# EAGLE design ospy_hw3.3 (EAGLE 9.5.2)
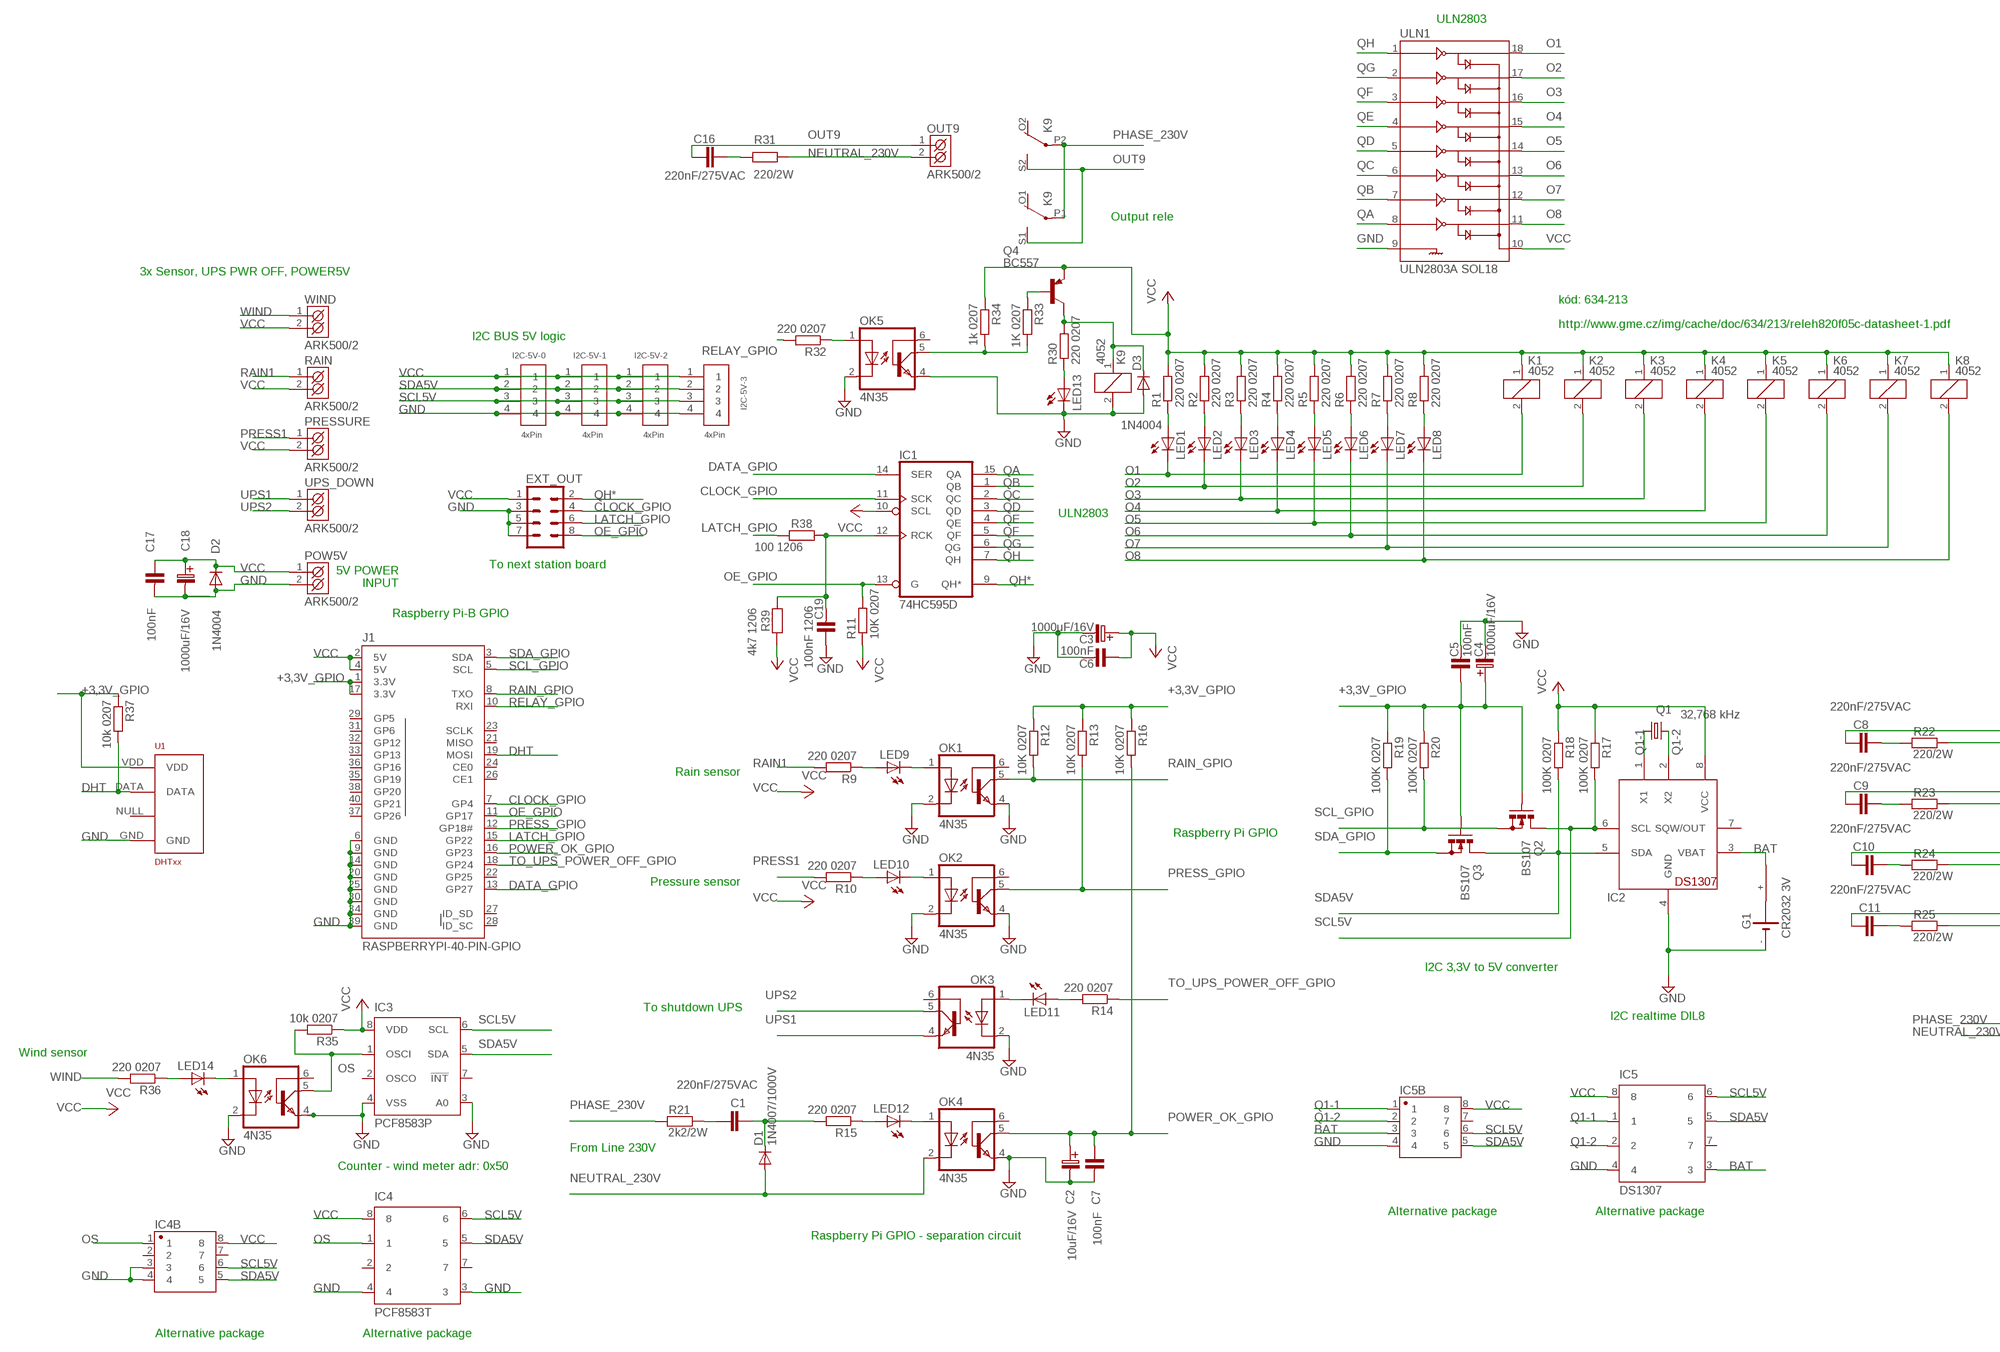
[diagram p0: schematic, sheet 1, part 1 of 2]
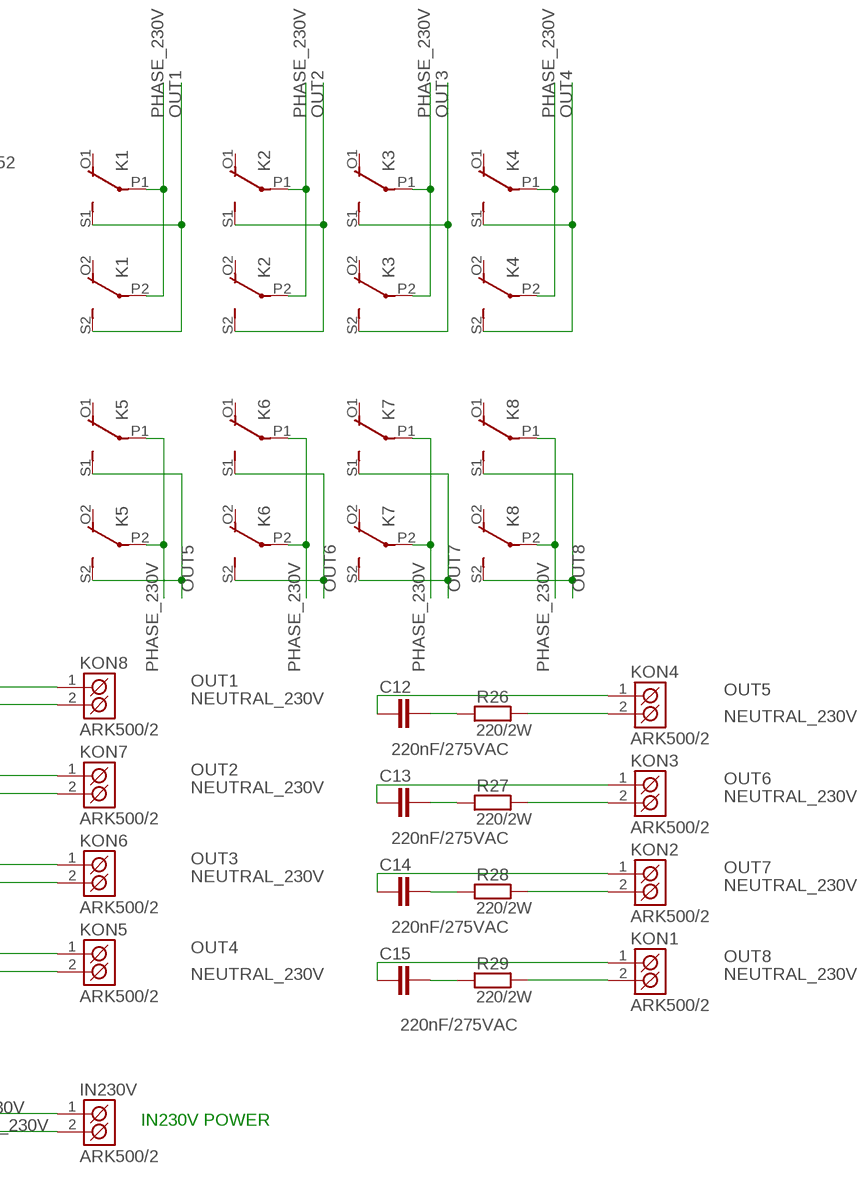
[diagram p1: schematic, sheet 1, part 2 of 2]

## Parts
C1  220nF/275VAC  C-EU225-087X268  [C225-087X268]
C2  10uF/16V  #_RADIAL_POUZDRA5  [C_EL_5]
C3  1000uF/16V  #_RADIAL_POUZDRA5  [C_EL_5]
C4  1000uF/16V  #_RADIAL_POUZDRA5  [C_EL_5]
C5  100nF  100N-J/63V  [RM5_2,5]
C6  100nF  100N-J/63V  [RM5_2,5]
C7  100nF  100N-J/63V  [RM5_2,5]
C8  220nF/275VAC  C-EU225-087X268  [C225-087X268]
C9  220nF/275VAC  C-EU225-087X268  [C225-087X268]
C10  220nF/275VAC  C-EU225-087X268  [C225-087X268]
C11  220nF/275VAC  C-EU225-087X268  [C225-087X268]
C12  220nF/275VAC  C-EU225-087X268  [C225-087X268]
C13  220nF/275VAC  C-EU225-087X268  [C225-087X268]
C14  220nF/275VAC  C-EU225-087X268  [C225-087X268]
C15  220nF/275VAC  C-EU225-087X268  [C225-087X268]
C16  220nF/275VAC  C-EU225-087X268  [C225-087X268]
C17  100nF  100N-J/63V  [RM5_2,5]
C18  1000uF/16V  #_RADIAL_POUZDRA5  [C_EL_5]
C19  100nF 1206  C-KER_1206  [1206]
D1  1N4007/1000V  1N4004  [DO41-10]
D2  1N4004  [DO41-10]
D3  1N4004  [DO41-10]
EXT_OUT  M04X2  [2X4]
G1  CR2032 3V  B2430UNI  [B2430UNI]
I2C-5V-0  4xPin  1X4-CLEANBIG  [1X04-CLEANBIG]
I2C-5V-1  4xPin  1X4-CLEANBIG  [1X04-CLEANBIG]
I2C-5V-2  4xPin  1X4-CLEANBIG  [1X04-CLEANBIG]
I2C-5V-3  4xPin  1X4-CLEANBIG  [1X04-CLEANBIG]
IC1  74HC595D  [SO16]
IC2  DS1307  [DIL08]
IC3  PCF8583P  [DIL08]
IC4  PCF8583T  [SO8-7_5]
IC4B  GENERIC-SOIC8  [SO08-UNIVERSAL]
IC5  DS1307  PCF8583T  [SO8-7_5]
IC5B  GENERIC-SOIC8  [SO08-UNIVERSAL]
IN230V  ARK500/2  [ARK500/2]
J1  RASPBERRYPI-40-PIN-GPIO  [2X20-SHROUDED]
K1  4052  [F4052]
K2  4052  [F4052]
K3  4052  [F4052]
K4  4052  [F4052]
K5  4052  [F4052]
K6  4052  [F4052]
K7  4052  [F4052]
K8  4052  [F4052]
K9  4052  [F4052]
KON1  ARK500/2  [ARK500/2]
KON2  ARK500/2  [ARK500/2]
KON3  ARK500/2  [ARK500/2]
KON4  ARK500/2  [ARK500/2]
KON5  ARK500/2  [ARK500/2]
KON6  ARK500/2  [ARK500/2]
KON7  ARK500/2  [ARK500/2]
KON8  ARK500/2  [ARK500/2]
LED1  LED3MM  [LED3MM]
LED2  LED3MM  [LED3MM]
LED3  LED3MM  [LED3MM]
LED4  LED3MM  [LED3MM]
LED5  LED3MM  [LED3MM]
LED6  LED3MM  [LED3MM]
LED7  LED3MM  [LED3MM]
LED8  LED3MM  [LED3MM]
LED9  LED3MM  [LED3MM]
LED10  LED3MM  [LED3MM]
LED11  LED3MM  [LED3MM]
LED12  LED3MM  [LED3MM]
LED13  LED3MM  [LED3MM]
LED14  LED3MM  [LED3MM]
OK1  4N35  [DIL06]
OK2  4N35  [DIL06]
OK3  4N35  [DIL06]
OK4  4N35  [DIL06]
OK5  4N35  [DIL06]
OK6  4N35  [DIL06]
OUT9  ARK500/2  [ARK500/2]
POW5V  ARK500/2  [ARK500/2]
PRESSURE  ARK500/2  [ARK500/2]
Q1  32,768 kHz  CRYSTALTC26V  [TC26V]
Q2  BS107  BS170  [SOT54E]
Q3  BS107  BS170  [SOT54E]
Q4  BC557  [TO92]
R1  220 0207  R-EU_0207/10  [0207/10]
R2  220 0207  R-EU_0207/10  [0207/10]
R3  220 0207  R-EU_0207/10  [0207/10]
R4  220 0207  R-EU_0207/10  [0207/10]
R5  220 0207  R-EU_0207/10  [0207/10]
R6  220 0207  R-EU_0207/10  [0207/10]
R7  220 0207  R-EU_0207/10  [0207/10]
R8  220 0207  R-EU_0207/10  [0207/10]
R9  220 0207  R-EU_0207/10  [0207/10]
R10  220 0207  R-EU_0207/10  [0207/10]
R11  10K 0207  R-EU_0207/10  [0207/10]
R12  10K 0207  R-EU_0207/10  [0207/10]
R13  10K 0207  R-EU_0207/10  [0207/10]
R14  220 0207  R-EU_0207/10  [0207/10]
R15  220 0207  R-EU_0207/10  [0207/10]
R16  10K 0207  R-EU_0207/10  [0207/10]
R17  100K 0207  R-EU_0207/10  [0207/10]
R18  100K 0207  R-EU_0207/10  [0207/10]
R19  100K 0207  R-EU_0207/10  [0207/10]
R20  100K 0207  R-EU_0207/10  [0207/10]
R21  2k2/2W  W2_220R  [R__2W]
R22  220/2W  W2_220R  [R__2W]
R23  220/2W  W2_220R  [R__2W]
R24  220/2W  W2_220R  [R__2W]
R25  220/2W  W2_220R  [R__2W]
R26  220/2W  W2_220R  [R__2W]
R27  220/2W  W2_220R  [R__2W]
R28  220/2W  W2_220R  [R__2W]
R29  220/2W  W2_220R  [R__2W]
R30  220 0207  R-EU_0207/10  [0207/10]
R31  220/2W  W2_220R  [R__2W]
R32  220 0207  R-EU_0207/10  [0207/10]
R33  1K 0207  R-EU_0207/10  [0207/10]
R34  1k 0207  R-EU_0207/10  [0207/10]
R35  10k 0207  R-EU_0207/10  [0207/10]
R36  220 0207  R-EU_0207/10  [0207/10]
R37  10k 0207  R-EU_0207/10  [0207/10]
R38  100 1206  R_1206  [1206]
R39  4k7 1206  R_1206  [1206]
RAIN  ARK500/2  [ARK500/2]
U1  DHTxx  RHT03_DHT-22_AM2302RA  [RHT03_DHT-22/RA]
ULN1  ULN2803A SOL18  ULN2803SOICW  [SO18L]
UPS_DOWN  ARK500/2  [ARK500/2]
WIND  ARK500/2  [ARK500/2]

## Nets
+3,3V_GPIO: C4.C+(C_EL+) C5.1 J1.1(3.3V) J1.17(3.3V) Q2.G Q3.G R12.1 R13.1 R16.1 R19.1 R20.1 R37.1 U1.VDD
BAT: G1.+ IC2.3(VBAT) IC5.3 IC5B.3
CLOCK_GPIO: EXT_OUT.4 IC1.11(SCK) J1.7(GP4)
DATA_GPIO: IC1.14(SER) J1.13(GP27)
DHT: J1.19(MOSI) R37.2 U1.DATA
GND: C2.C-(C_EL-) C3.C-(C_EL-) C4.C-(C_EL-) C5.2 C6.2 C7.2 C17.2 C18.C-(C_EL-) C19.1 D2.A D3.A EXT_OUT.3 EXT_OUT.5 EXT_OUT.7 G1.- I2C-5V-0.4 I2C-5V-1.4 I2C-5V-2.4 I2C-5V-3.4 IC2.4(GND) IC3.3(A0) IC3.4(VSS) IC4.3 IC4.4 IC4B.3 IC4B.4 IC5.4 IC5B.4 J1.6(GND) J1.9(GND) J1.14(GND) J1.20(GND) J1.25(GND) J1.30(GND) J1.34(GND) J1.39(GND) K9.2 LED13.K(C) OK1.2(C) OK1.4(EMI) OK2.2(C) OK2.4(EMI) OK3.2(C) OK4.4(EMI) OK5.2(C) OK5.4(EMI) OK6.2(C) OK6.4(EMI) POW5V.2(K2) U1.GND ULN1.9
LATCH_GPIO: EXT_OUT.6 J1.15(GP22) R38.1
N$1: LED14.A R36.1
N$3: LED14.K(C) OK6.1(A)
N$13: C19.2 IC1.12(RCK) R38.2 R39.2
N$17: LED1.A R1.1
N$18: LED2.A R2.1
N$19: LED3.A R3.1
N$20: LED4.A R4.1
N$21: LED5.A R5.1
N$22: LED6.A R6.1
N$23: LED7.A R7.1
N$24: LED8.A R8.1
N$26: LED9.A R9.1
N$27: LED9.K(C) OK1.1(A)
N$28: LED10.K(C) OK2.1(A)
N$29: LED10.A R10.1
N$30: LED12.A R15.1
N$31: LED12.K(C) OK4.1(A)
N$32: LED11.K(C) OK3.1(A)
N$33: LED11.A R14.2
N$36: C10.2 R24.1
N$37: C9.2 R23.1
N$38: C1.1 R21.2
N$39: C8.2 R22.1
N$40: C11.2 R25.1
N$41: C12.2 R26.1
N$42: Q4.2(B) R33.1
N$43: C13.2 R27.1
N$44: C14.2 R28.1
N$45: C15.2 R29.1
N$46: LED13.A R30.1
N$47: C16.2 R31.1
N$49: OK5.1(A) R32.1
N$50: OK5.5(COL) R33.2 R34.2
N$51: D3.C K9.1 Q4.3(C) R30.2
NEUTRAL_230V: D1.A IN230V.2(K2) KON1.2(K2) KON2.2(K2) KON3.2(K2) KON4.2(K2) KON5.2(K2) KON6.2(K2) KON7.2(K2) KON8.2(K2) OK4.2(C) OUT9.2(K2) R22.2 R23.2 R24.2 R25.2 R26.2 R27.2 R28.2 R29.2 R31.2
O1: K1.2 LED1.K(C) ULN1.18
O2: K2.2 LED2.K(C) ULN1.17
O3: K3.2 LED3.K(C) ULN1.16
O4: K4.2 LED4.K(C) ULN1.15
O5: K5.2 LED5.K(C) ULN1.14
O6: K6.2 LED6.K(C) ULN1.13
O7: K7.2 LED7.K(C) ULN1.12
O8: K8.2 LED8.K(C) ULN1.11
OE_GPIO: EXT_OUT.8 IC1.13(G) J1.11(GP17) R11.2
OS: IC3.1(OSCI) IC4.1 IC4B.1 OK6.5(COL) R35.2
OUT1: C8.1 K1.S1(2:S) K1.S2(3:S) KON8.1(K1)
OUT2: C9.1 K2.S1(2:S) K2.S2(3:S) KON7.1(K1)
OUT3: C10.1 K3.S1(2:S) K3.S2(3:S) KON6.1(K1)
OUT4: C11.1 K4.S1(2:S) K4.S2(3:S) KON5.1(K1)
OUT5: C12.1 K5.S1(2:S) K5.S2(3:S) KON4.1(K1)
OUT6: C13.1 K6.S1(2:S) K6.S2(3:S) KON3.1(K1)
OUT7: C14.1 K7.S1(2:S) K7.S2(3:S) KON2.1(K1)
OUT8: C15.1 K8.S1(2:S) K8.S2(3:S) KON1.1(K1)
OUT9: C16.1 K9.S1(2:S) K9.S2(3:S) OUT9.1(K1)
PHASE_230V: IN230V.1(K1) K1.P1(2:P) K1.P2(3:P) K2.P1(2:P) K2.P2(3:P) K3.P1(2:P) K3.P2(3:P) K4.P1(2:P) K4.P2(3:P) K5.P1(2:P) K5.P2(3:P) K6.P1(2:P) K6.P2(3:P) K7.P1(2:P) K7.P2(3:P) K8.P1(2:P) K8.P2(3:P) K9.P1(2:P) K9.P2(3:P) R21.1
POWER_OK_GPIO: C2.C+(C_EL+) C7.1 J1.16(GP23) OK4.5(COL) R16.2
PRESS1: PRESSURE.1(K1) R10.2
PRESS_GPIO: J1.12(GP18#) OK2.5(COL) R13.2
Q1-1: IC2.1(X1) IC5.1 IC5B.1 Q1.1
Q1-2: IC2.2(X2) IC5.2 IC5B.2 Q1.2
QA: IC1.15(QA) ULN1.8
QB: IC1.1(QB) ULN1.7
QC: IC1.2(QC) ULN1.6
QD: IC1.3(QD) ULN1.5
QE: IC1.4(QE) ULN1.4
QF: IC1.5(QF) ULN1.3
QG: IC1.6(QG) ULN1.2
QH: IC1.7(QH) ULN1.1
QH*: EXT_OUT.2 IC1.9(QH*)
RAIN1: R9.2 RAIN.1(K1)
RAIN_GPIO: J1.8(TXO) OK1.5(COL) R12.2
RELAY_GPIO: J1.10(RXI) R32.2
SCL5V: I2C-5V-0.3 I2C-5V-1.3 I2C-5V-2.3 I2C-5V-3.3 IC2.6(SCL) IC3.6(SCL) IC4.6 IC4B.6 IC5.6 IC5B.6 Q2.D R17.2
SCL_GPIO: J1.5(SCL) Q2.S R20.2
SDA5V: I2C-5V-0.2 I2C-5V-1.2 I2C-5V-2.2 I2C-5V-3.2 IC2.5(SDA) IC3.5(SDA) IC4.5 IC4B.5 IC5.5 IC5B.5 Q3.D R18.2
SDA_GPIO: J1.3(SDA) Q3.S R19.2
TO_UPS_POWER_OFF_GPIO: J1.18(GP24) R14.1
UPS1: OK3.4(EMI) UPS_DOWN.1(K1)
UPS2: OK3.5(COL) UPS_DOWN.2(K2)
UPS_POWER_OK: C1.2 D1.C R15.2
VCC: C3.C+(C_EL+) C6.1 C17.1 C18.C+(C_EL+) D2.C EXT_OUT.1 I2C-5V-0.1 I2C-5V-1.1 I2C-5V-2.1 I2C-5V-3.1 IC1.10(SCL) IC2.8(VCC) IC3.8(VDD) IC4.8 IC4B.8 IC5.8 IC5B.8 J1.2(5V) J1.4(5V) K1.1 K2.1 K3.1 K4.1 K5.1 K6.1 K7.1 K8.1 POW5V.1(K1) PRESSURE.2(K2) Q4.1(E) R1.2 R2.2 R3.2 R4.2 R5.2 R6.2 R7.2 R8.2 R11.1 R17.1 R18.1 R34.1 R35.1 R39.1 RAIN.2(K2) ULN1.10 WIND.2(K2)
WIND: R36.2 WIND.1(K1)
Unconnected: G1.+@1(+) G1.+@2(+) G1.+@3(+) G1.+@4(+) G1.-@1(-) IC2.7(SQW/OUT) IC3.2(OSCO) IC3.7(!INT) IC4.2 IC4.7 IC4B.2 IC4B.7 IC5.7 IC5B.7 J1.21(MISO) J1.22(GP25) J1.23(SCLK) J1.24(CE0) J1.26(CE1) J1.27(ID_SD) J1.28(ID_SC) J1.29(GP5) J1.31(GP6) J1.32(GP12) J1.33(GP13) J1.35(GP19) J1.36(GP16) J1.37(GP26) J1.38(GP20) J1.40(GP21) K1.O1(2:O) K1.O2(3:O) K2.O1(2:O) K2.O2(3:O) K3.O1(2:O) K3.O2(3:O) K4.O1(2:O) K4.O2(3:O) K5.O1(2:O) K5.O2(3:O) K6.O1(2:O) K6.O2(3:O) K7.O1(2:O) K7.O2(3:O) K8.O1(2:O) K8.O2(3:O) K9.O1(2:O) K9.O2(3:O) OK1.6(BAS) OK2.6(BAS) OK3.6(BAS) OK4.6(BAS) OK5.6(BAS) OK6.6(BAS) U1.NULL

## Notes on the sheet
- ULN2803
- Output rele
- 3x Sensor, UPS PWR OFF, POWER5V
- kód: 634-213
- http://www.gme.cz/img/cache/doc/634/213/releh820f05c-datasheet-1.pdf
- I2C BUS 5V logic
- ULN2803
- To next station board
- 5V POWER
  INPUT
- Raspberry Pi-B GPIO
- Rain sensor
- Raspberry Pi GPIO
- Pressure sensor
- I2C 3,3V to 5V converter
- To shutdown UPS | I2C realtime DIL8
- IN230V POWER
- Wind sensor
- From Line 230V
- Counter - wind meter adr: 0x50
- Alternative package | Alternative package
- Raspberry Pi GPIO - separation circuit
- Alternative package | Alternative package

## Power pins joined to a net without a drawn wire
GND: IC1.8(GND)
VCC: IC1.16(VCC)

## Library data of the parts
C1 C8-C16 = rcl:C-EU: CAPACITOR, European symbol
C2-C4 C18 = #PaJa_C-el_2:#_RADIAL_POUZDRA
C5-C7 C17 = #PaJa_C-folie:100N-J/63V
C19 = #PaJa_31:C-KER: Kondenzator - keramicky
D1 = diode:1N4004: DIODE
D2 D3 = adafruit:1N4004: DIODE
EXT_OUT = SparkFun-Connectors:M04X2: .1" header, two rows of four.
G1 = battery:B2430UNI: LI BATTERY
I2C-5V-0 I2C-5V-1-I2C-5V-3 = adafruit:1X4: 4-pin connector
IC1 = 74xx-eu:74*595: 8-bit SHIFT REGISTER, output latch
IC2 = adafruit:DS1307: DS1307 Real time clock (RTC) with battery backup ability. Talk to it via i2c
IC3 = ds1307_pcf8583:PCF8583: I2C-Bus CLOCK/CALENDAR
IC4 IC5 = _SO8_ds1307_pcf8583:PCF8583: I2C-Bus CLOCK/CALENDAR
IC4B IC5B = SparkFun-Retired:GENERIC-SOIC8: A placeholder for generic narrow & wide SOIC8 foorptints - used on the DIP adapter board. Has strange reference to IC-10141, a Seven Band Graphic Equalizer Display Filter SOIC-8 VFP: IC-10141
IN230V KON1-KON8 OUT9 POW5V PRESSURE RAIN UPS_DOWN WIND = #PaJa_konektory:ARK500/2: Svorkovnice - roztec 5mm - dvojita
J1 = SparkFun-Boards:RASPBERRYPI-40-PIN-GPIO: Second Generation Raspberry Pi GPIO Header 2x20 pin connector, as found on B, B+, A+ models.
K1-K9 = relay:4052: RELAY 2 x switch, Finder; OC_FARNELL: unknown; OC_NEWARK: unknown
LED1-LED14 = adafruit:LED: LED OSRAM: - CHIPLED LG R971, LG N971, LY N971, LG Q971, LY Q971, LO R971, LY R971 LH N974, LH R974 LS Q976, LO Q976, LY Q976 LO Q996 - Hyper CHIPLED LW Q18S LB Q993, LB Q99A, LB R99A - SideLED LS A670, LO A670, LY A670, LG A670, LP A670 LB A673, LV A673, LT A673, LW A673 LH A674 LY A675 LS A676, LA A676, LO A676, LY A676, LW A676 LS A679, LY A679, LG A679 - Hyper Micro SIDELED® LS Y876, LA Y876, LO Y876, LY Y876 LT Y87S - SmartLED LW L88C, LW L88S LB L89C, LB L89S, LG L890 LS L89K, LO L89K, LY L89K LS L896, LA L896, LO L896, LY L896 - TOPLED LS T670, LO T670, LY T670, LG T670, LP T670 LSG T670, LSP T670, LSY T670, LOP T670, LYG T670 LG T671, LOG T671, LSG T671 LB T673, LV T673, LT T673, LW T673 LH T674 LS T676, LA T676, LO T676, LY T676, LB T676, LH T676, LSB T676, LW T676 LB T67C, LV T67C, LT T67C, LS T67K, LO T67K, LY T67K, LW E67C LS E67B, LA E67B, LO E67B, LY E67B, LB E67C, LV E67C, LT E67C LW T67C LS T679, LY T679, LG T679 LS T770, LO T770, LY T770, LG T770, LP T770 LB T773, LV T773, LT T773, LW T773 LH T774 LS E675, LA E675, LY E675, LS T675 LS T776, LA T776, LO T776, LY T776, LB T776 LHGB T686 LT T68C, LB T68C - Hyper Mini TOPLED® LB M676 - Mini TOPLED Santana® LG M470 LS M47K, LO M47K, LY M47K Source: http://www.osram.convergy.de/
OK1-OK6 = optocoupler:4N35: MOTOROLA OPTO COUPLER; MF: FAIRCHILD SEMICONDUCTOR; MPN: 4N35; OC_FARNELL: 1328375; OC_NEWARK: 72K9946
Q1 = crystal:CRYSTAL: CRYSTAL; OC_FARNELL: unknown; OC_NEWARK: unknown
Q2 Q3 = transistor-small-signal:BS170: N-CHANNEL MOS FET
Q4 = transistor-pnp:BC557: PNP Transistor
R1-R20 R30 R32-R37 = rcl:R-EU_: RESISTOR, European symbol
R21-R29 R31 = #PaJa_R:W2_220R
R38 R39 = #PaJa_31:R: Rezistor
U1 = RHT03_DHT-22_AM2302:RHT03_DHT-22_AM2302: RHT03 / DHT-22 / AM2302 Packages and symbol for the RHT03 / DHT-22 relative humidity and temperature sensor. Note: The AM2302 is a wired version of the DHT-22 which typically requires less clearance and is thus provided as a separate package.; PROD_ID: SEN-10167
ULN1 = SparkFun-PowerIC:ULN2803: Darlington Driver ULN2803 Darlington array. 500mA max per channel, 8-channel package. Spark Fun Electronics SKU : COM-00312

## Board
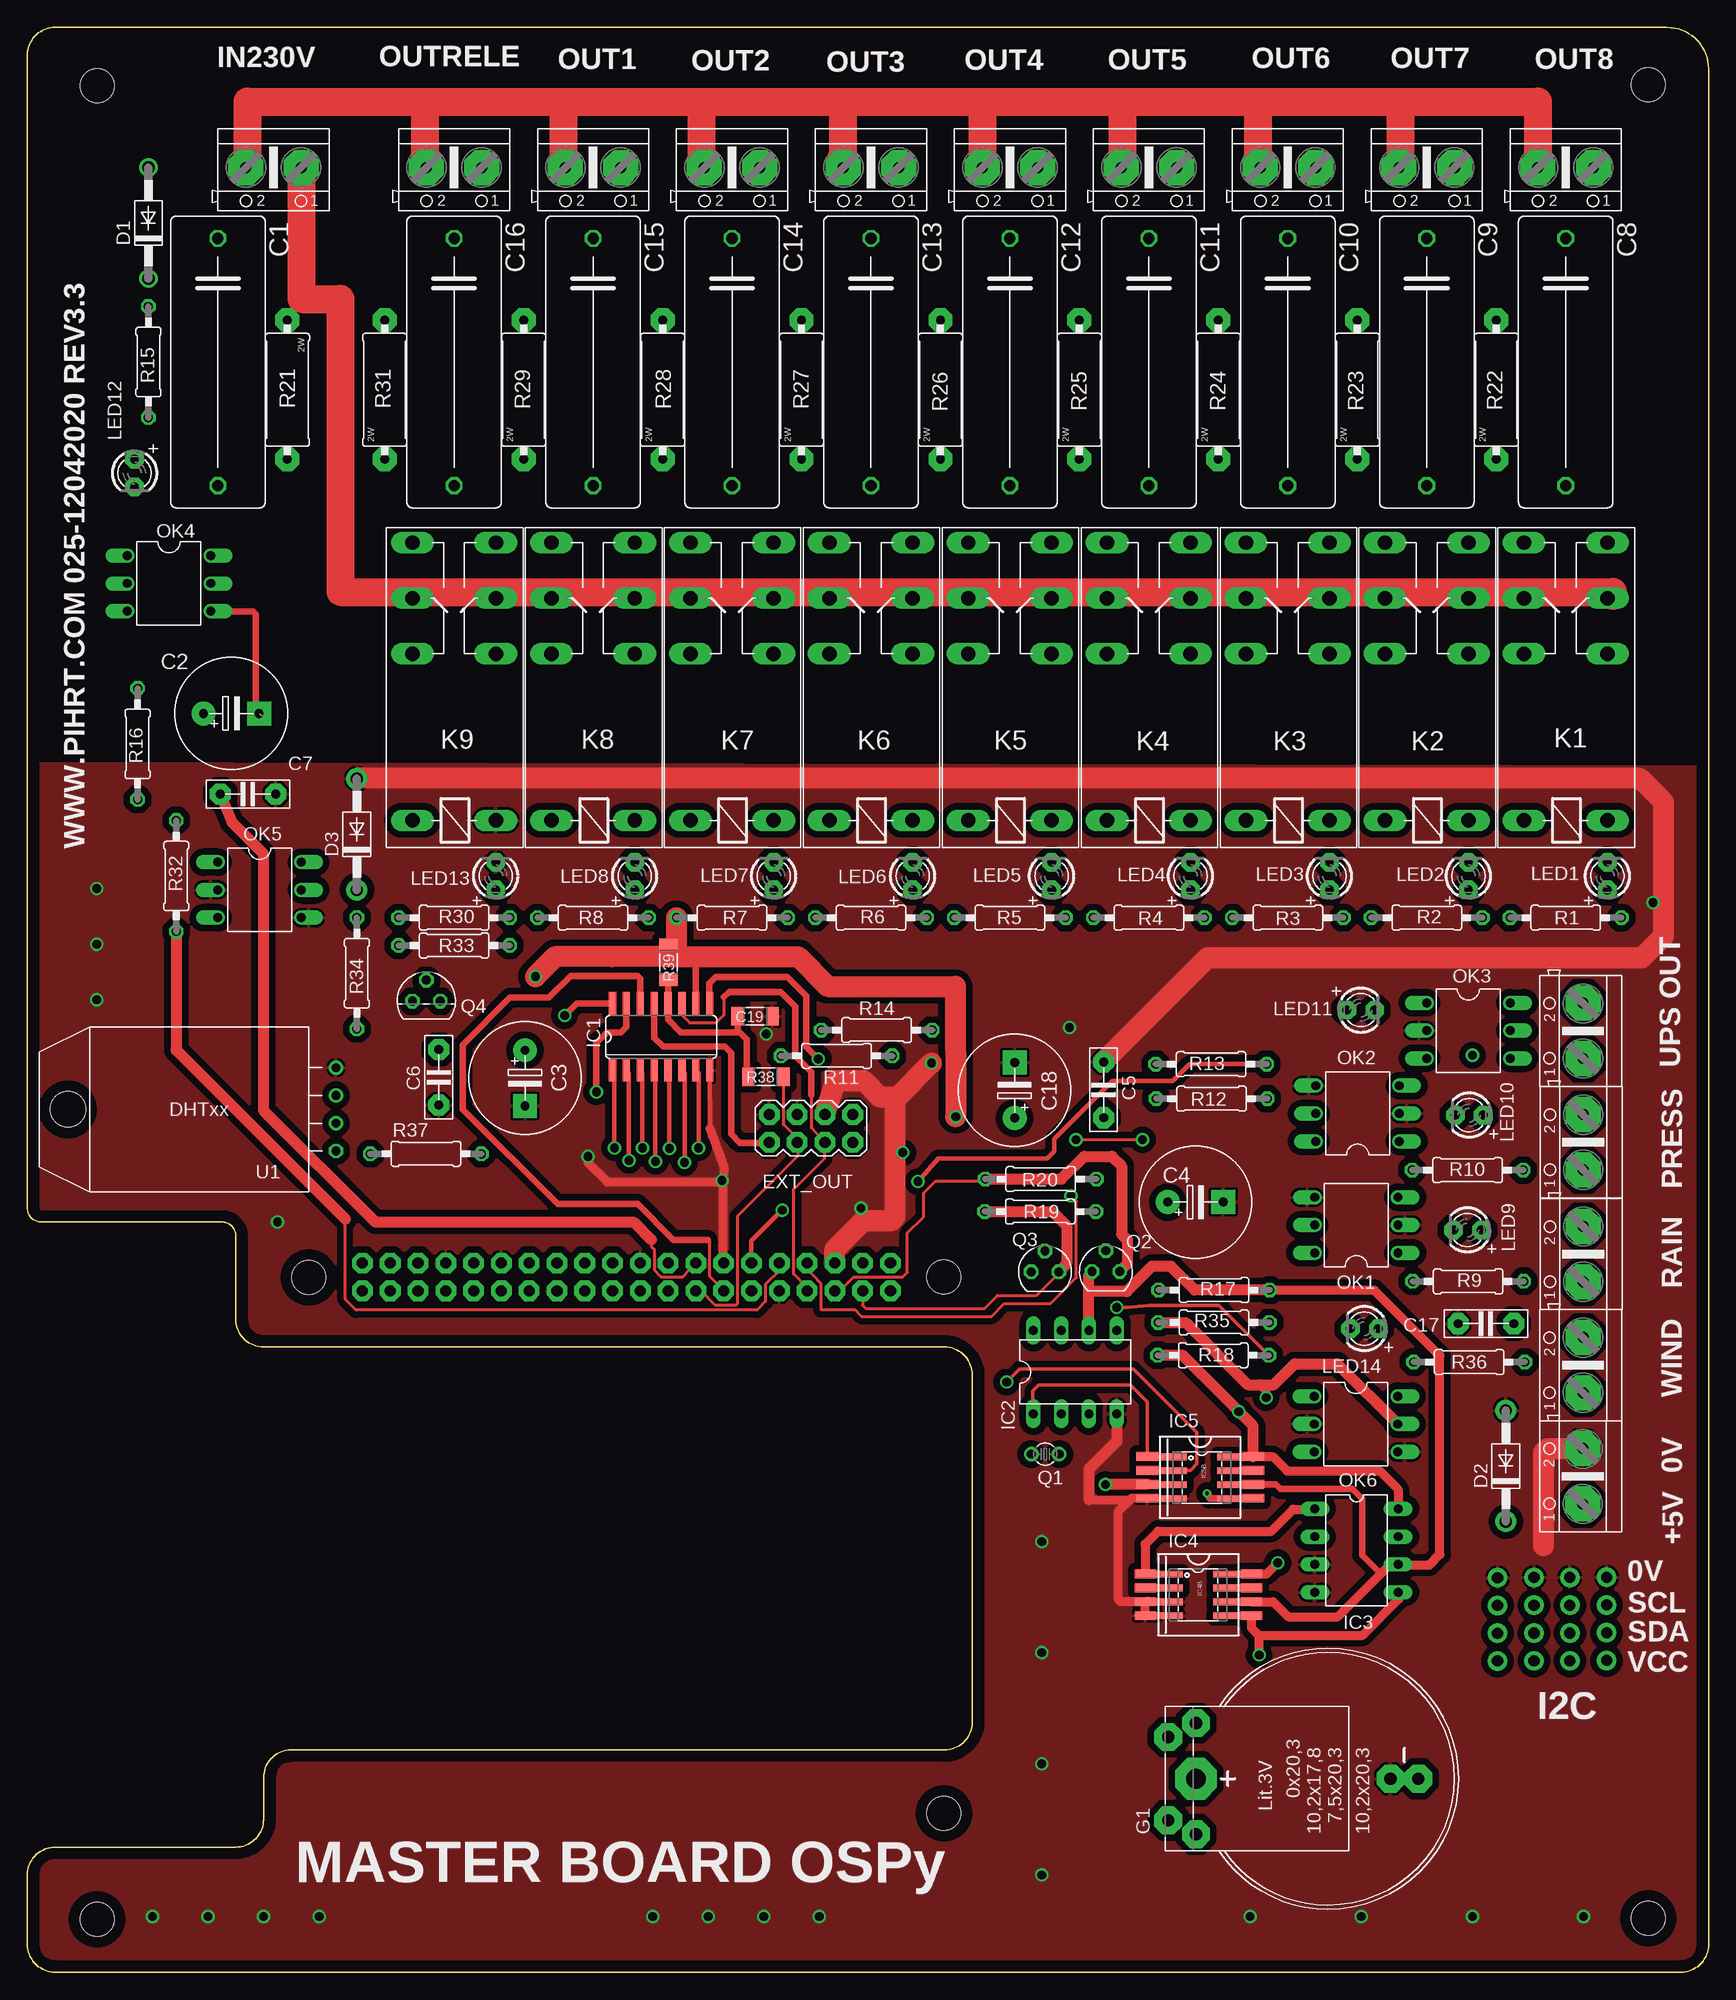
[diagram p2: board, top side]
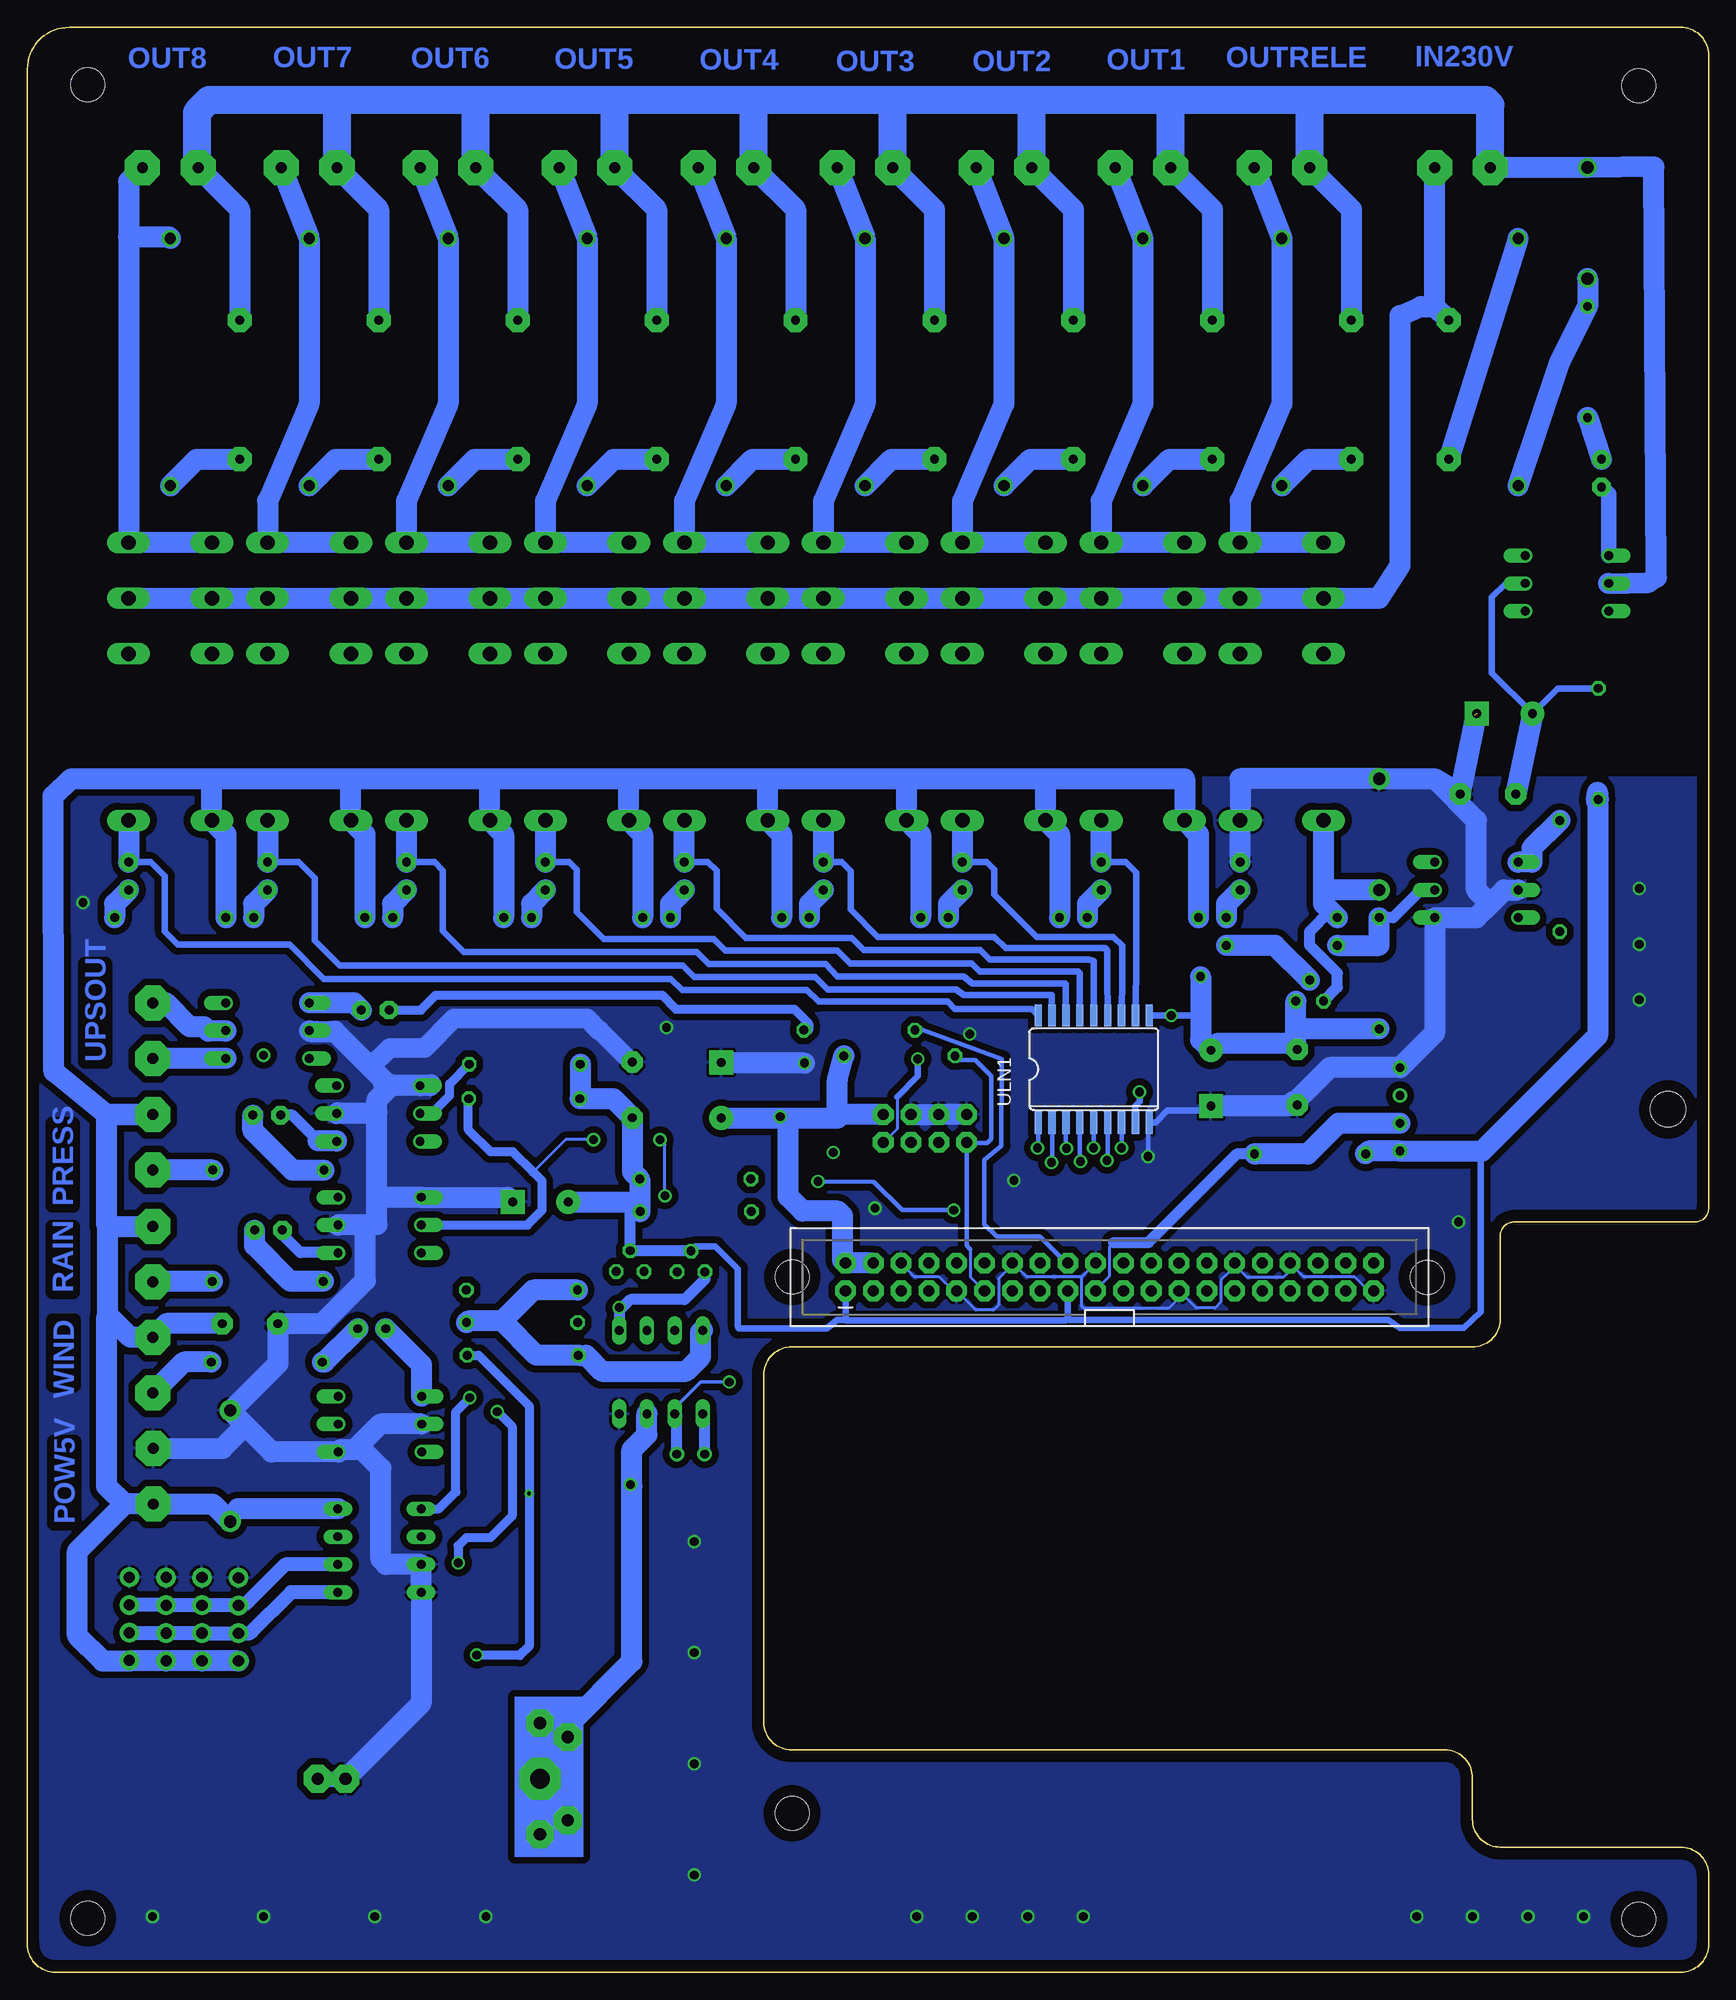
[diagram p3: board, bottom side, seen from below]

Size 153.67 x 177.8 mm. Coordinates in mm from the lower left corner, seen from the top.
Outline: 21.59,57.15 83.82,57.15 arc-90 86.36,54.61 86.36,22.86 arc-90 83.82,20.32 24.13,20.32 arc90 21.59,17.78 21.59,13.97 arc-90 19.05,11.43 2.54,11.43 arc90 0,8.89 0,2.54 arc90 2.54,0 151.13,0 arc90 153.67,2.54 153.67,173.99 arc90 149.86,177.8 2.54,177.8 arc90 0,175.26 0,69.85 arc90 1.27,68.58 17.78,68.58 arc-90 19.05,67.31 19.05,59.69 arc90 21.59,57.15
Copper layers (1*16): Top 0.018mm / dielectric 1.5mm / Bottom 0.018mm
Design rules "2_vrstvy_pragoboard *": minimum track width 0.15mm, minimum drill 0.3mm, track to track 0.15mm, track to pad 0.15mm, pad to pad 0.15mm, via to via 0.15mm, smd to smd 0.15mm, copper to edge 40mil, drill to drill 8mil, minimum pad ring 10mil, minimum via ring 8mil, stop-mask expansion 4mil, vias tented up to drill 0mil, thermal gap 10mil
Holes 3.1 mm at 6.39,172.44 148.16,172.57 6.37,4.84 148.16,4.93 83.78,14.54 25.74,63.52 83.77,63.55

### Footprints (pad centres in the part's own frame; a part is rotated, then mirrored left to right if it is on the bottom)
C225-087X268 = drill 1.016 octagon: 1 -11.303,0; 2 11.303,0
C_EL_5 = drill 0.813 pad 2.184: C+ -2.54,0 | drill 0.813 pad 2.184 square: C- 2.54,0
RM5_2,5 = drill 0.813 pad 1.93 octagon: 1 -2.54,0; 2 2.54,0
1206 = smd 1.143 x 1.702: 1 -1.587,0; 2 1.587,0
DO41-10 = drill 1.118: A 5.08,0; C -5.08,0
DO41-10' = drill 1.118 pad 1.93: A 5.08,0; C -5.08,0
2X4 = drill 1.016 pad 1.88 octagon: 1 -3.81,-1.27; 2 -3.81,1.27; 3 -1.27,-1.27; 4 -1.27,1.27; 5 1.27,-1.27; 6 1.27,1.27; 7 3.81,-1.27; 8 3.81,1.27
B2430UNI = drill 1.118 pad 2.54 octagon: + 3.81,14.605; +@1 -3.81,14.605; +@2 -5.08,12.065; +@3 5.08,12.065; - 0,-5.715; -@1 0,-8.255 | drill 1.803 pad 3.81 octagon: +@4 0,12.065
1X04-CLEANBIG = drill 1.016 pad 1.778: 1 -3.81,0; 2 -1.27,0; 3 1.27,0; 4 3.81,0
SO16 = smd 0.66 x 2.032: 1 -4.445,-3.073; 2 -3.175,-3.073; 3 -1.905,-3.073; 4 -0.635,-3.073; 5 0.635,-3.073; 6 1.905,-3.073; 7 3.175,-3.073; 8 4.445,-3.073; 9 4.445,3.073; 10 3.175,3.073; 11 1.905,3.073; 12 0.635,3.073; 13 -0.635,3.073; 14 -1.905,3.073; 15 -3.175,3.073; 16 -4.445,3.073
DIL08 = drill 0.813 long: 1 -3.81,-3.81; 2 -1.27,-3.81; 3 1.27,-3.81; 4 3.81,-3.81; 5 3.81,3.81; 6 1.27,3.81; 7 -1.27,3.81; 8 -3.81,3.81
SO8-7_5 = smd 0.8 x 2: 1 -1.905,-4.845; 2 -0.635,-4.845; 3 0.635,-4.845; 4 1.905,-4.845; 5 1.905,4.845; 6 0.635,4.845; 7 -0.635,4.845; 8 -1.905,4.845
SO08-UNIVERSAL = smd 0.61 x 3.353: 1 -1.905,-3.073; 2 -0.635,-3.073; 3 0.635,-3.073; 4 1.905,-3.073; 5 1.905,3.073; 6 0.635,3.073; 7 -0.635,3.073; 8 -1.905,3.073
ARK500/2 = drill 1 pad 3.2 octagon: 1 -2.54,0; 2 2.54,0
2X20-SHROUDED = drill 1.016 pad 1.88 octagon: 1 -1.27,24.13; 2 1.27,24.13; 3 -1.27,21.59; 4 1.27,21.59; 5 -1.27,19.05; 6 1.27,19.05; 7 -1.27,16.51; 8 1.27,16.51; 9 -1.27,13.97; 10 1.27,13.97; 11 -1.27,11.43; 12 1.27,11.43; 13 -1.27,8.89; 14 1.27,8.89; 15 -1.27,6.35; 16 1.27,6.35; 17 -1.27,3.81; 18 1.27,3.81; 19 -1.27,1.27; 20 1.27,1.27; 21 -1.27,-1.27; 22 1.27,-1.27; 23 -1.27,-3.81; 24 1.27,-3.81; 25 -1.27,-6.35; 26 1.27,-6.35; 27 -1.27,-8.89; 28 1.27,-8.89; 29 -1.27,-11.43; 30 1.27,-11.43; 31 -1.27,-13.97; 32 1.27,-13.97; 33 -1.27,-16.51; 34 1.27,-16.51; 35 -1.27,-19.05; 36 1.27,-19.05; 37 -1.27,-21.59; 38 1.27,-21.59; 39 -1.27,-24.13; 40 1.27,-24.13
F4052 = drill 1.321 long: 1 -3.81,3.81; 2 -3.81,-3.81; O1 11.43,-3.81; O2 11.43,3.81; P1 16.51,-3.81; P2 16.51,3.81; S1 21.59,-3.81; S2 21.59,3.81
LED3MM = drill 0.813 pad 1.676 octagon: A -1.27,0; K 1.27,0
DIL06 = drill 0.813 offset: 1 -2.54,-3.81; 2 0,-3.81; 3 2.54,-3.81; 4 2.54,3.81; 5 0,3.81; 6 -2.54,3.81
TC26V = drill 0.813: 1 -1.27,0; 2 1.27,0
SOT54E = drill 0.813 octagon: D -1.27,0; G 0,1.905; S 1.27,0
TO92 = drill 0.813 octagon: 1 1.27,0; 2 0,1.905; 3 -1.27,0
0207/10 = drill 0.813 octagon: 1 -5.08,0; 2 5.08,0
R__2W = drill 0.813 pad 2.184 octagon: 1 -6.35,0; 2 6.35,0
RHT03_DHT-22/RA = drill 0.8: DATA -1.27,0; GND 3.81,0; NULL 1.27,0 | drill 0.8 octagon: VDD -3.81,0 | hole 3.25: 0,24.5
SO18L = smd 0.66 x 2.032: 1 -0.635,-4.902; 2 0.635,-4.902; 3 1.905,-4.902; 4 3.175,-4.902; 5 4.445,-4.902; 6 5.715,-4.902; 7 6.985,-4.902; 8 8.255,-4.902; 9 9.525,-4.902; 10 9.525,4.902; 11 8.255,4.902; 12 6.985,4.902; 13 5.715,4.902; 14 4.445,4.902; 15 3.175,4.902; 16 1.905,4.902; 17 0.635,4.902; 18 -0.635,4.902

### Placement (x,y rotation side)
C1  17.42,147.2 270 top
C2  18.64,115.07 0 top
C3  45.49,81.74 270 top
C4  106.78,70.4 0 top
C5  98.37,80.66 90 top
C6  37.6,81.81 270 top
C7  20.16,107.71 0 top
C8  140.61,147.2 270 top
C9  127.91,147.2 270 top
C10  115.21,147.2 270 top
C11  102.51,147.2 270 top
C12  89.81,147.2 270 top
C13  77.11,147.2 270 top
C14  64.41,147.2 270 top
C15  51.71,147.2 270 top
C16  39.01,147.2 270 top
C17  133.31,59.29 180 top
C18  90.24,80.62 90 top
C19  66.51,87.39 180 top
D1  11.07,159.9 90 top
D2  1N4004  [DO41-10']  135.14,46.28 90 top
D3  1N4004  [DO41-10']  30.12,104.02 90 top
EXT_OUT  71.63,77.14 180 top
G1  118.87,17.68 90 top
I2C-5V-0  134.37,32.26 90 top
I2C-5V-1  137.71,32.27 90 top
I2C-5V-2  140.99,32.27 90 top
I2C-5V-3  144.34,32.3 90 top
IC1  57.93,85.5 0 top
IC2  95.76,54.86 0 top
IC3  121.48,38.55 270 top
IC4  107.04,34.5 270 top
IC4B  106.99,34.49 270 top
IC5  107.2,45.24 270 top
IC5B  107.35,45.21 270 top
IN230V  22.5,164.98 180 top
J1  54.76,63.55 90 bottom
K1  140.61,109.1 90 top
K2  127.91,109.1 90 top
K3  115.21,109.1 90 top
K4  102.51,109.1 90 top
K5  89.81,109.1 90 top
K6  77.11,109.1 90 top
K7  64.41,109.1 90 top
K8  51.71,109.1 90 top
K9  39.01,109.1 90 top
KON1  51.71,164.98 180 top
KON2  64.41,164.98 180 top
KON3  77.11,164.98 180 top
KON4  89.81,164.98 180 top
KON5  102.51,164.98 180 top
KON6  115.21,164.98 180 top
KON7  127.91,164.98 180 top
KON8  140.61,164.98 180 top
LED1  144.42,100.21 90 top
LED2  131.72,100.21 90 top
LED3  119.02,100.21 90 top
LED4  106.32,100.21 90 top
LED5  93.62,100.21 90 top
LED6  80.92,100.21 90 top
LED7  68.22,100.21 90 top
LED8  55.52,100.21 90 top
LED9  131.63,67.85 180 top
LED10  131.79,78.35 180 top
LED11  121.88,87.96 0 top
LED12  9.8,137.04 270 top
LED13  42.82,100.21 90 top
LED14  122.2,58.83 180 top
OK1  121.47,68.3 90 top
OK2  121.59,78.5 90 top
OK3  131.71,86.08 270 top
OK4  12.94,126.97 270 top
OK5  21.23,98.94 270 top
OK6  121.43,50.1 270 top
OUT9  39.01,164.98 180 top
POW5V  142.16,45.33 90 top
PRESSURE  142.2,75.87 90 top
Q1  93.03,47.35 0 top
Q2  98.58,64.06 0 top
Q3  93.01,64.02 0 top
Q4  36.47,88.78 0 top
R1  140.61,96.4 180 top
R2  127.91,96.4 180 top
R3  115.21,96.4 180 top
R4  102.51,96.4 180 top
R5  89.81,96.4 180 top
R6  77.11,96.4 180 top
R7  64.41,96.4 180 top
R8  51.71,96.4 180 top
R9  131.69,63.15 0 top
R10  131.64,73.32 0 top
R11  73.96,83.78 180 top
R12  108.25,79.85 0 top
R13  108.2,83.01 0 top
R14  77.62,86.12 0 top
R15  11.07,147.2 90 top
R16  10.08,112.29 90 top
R17  108.47,62.36 0 top
R18  108.39,56.39 0 top
R19  92.58,69.54 180 top
R20  92.62,72.5 180 top
R21  23.77,144.66 270 top
R22  134.26,144.66 90 top
R23  121.56,144.66 90 top
R24  108.86,144.66 90 top
R25  96.16,144.66 90 top
R26  83.46,144.66 90 top
R27  70.76,144.66 90 top
R28  58.06,144.66 90 top
R29  45.36,144.66 90 top
R30  39.01,96.4 180 top
R31  32.66,144.66 90 top
R32  13.61,100.21 270 top
R33  39.01,93.86 180 top
R34  30.12,91.32 90 top
R35  108.45,59.4 180 top
R36  131.79,55.77 0 top
R37  36.43,74.82 0 top
R38  67.51,81.87 180 top
R39  58.59,92.33 270 top
RAIN  142.2,65.65 90 top
U1  28.21,78.88 90 top
ULN1  60.65,82.56 0 bottom
UPS_DOWN  142.19,86.05 90 top
WIND  142.19,55.5 90 top

### Tracks (layer width: path | path; a pad name or v marks a point on that pad's centre or on a via)
+3,3V_GPIO
  Bottom 0.61: J1.17 58.57,59.8 | 58.57,59.8 58.4,59.63 29.27,59.63 28.24,58.91 22.38,58.91 20.85,60.35 20.85,74.78 20.72,75.05 | 58.57,59.8 58.77,59.59 78.87,59.59 78.89,59.61 J1.1 78.89,59.72 78.99,59.61 79.63,59.61 80.63,58.85 88.65,58.85 88.72,59.13 88.72,64.3 90.78,66.36 92.58,66.36 Q3.G
  Bottom 1.016: Q3.G 98.54,65.92 Q2.G 98.58,70.39 98.59,70.4
  Bottom 1.93: R16.1 10.26,107.05 10.15,107.88 10.15,85.62 20.72,75.05 28.19,75.05 U1.VDD 31.1,75.07 R37.1 | R13.1 103.12,79.9 R12.1 100.1,79.85 C5.1 98.37,73.17 R20.1 97.7,70.03 | 97.7,70.03 97.7,69.58 R19.1 | C4.C+ 98.59,70.4 98.07,70.4 97.7,70.03
BAT  (via drill 0.8)
  Top 0.406: IC5B.3 102.38,44.57 IC5.3
  Top 1.016: IC5.3 98.57,44.6 v98.55,44.58
  Bottom 1.016: v98.55,44.58 98.55,44.52 98.41,44.38
  Bottom 1.93: G1.+ 104.27,22.54 98.41,28.4 98.41,44.38 98.41,47.76 97.05,49.12 97.05,51.04 IC2.3
CLOCK_GPIO
  Top 0.254: J1.7 71.27,62.55 70.03,63.81 70.03,71.58 72.87,74.39 72.87,75.84 EXT_OUT.4 71.64,77.2 71.64,80.17 | IC1.11 59.83,87.51 60.57,86.77 62.94,86.77 63.67,87.5 63.67,89.15
  Top 0.61: 71.64,80.17 71.64,82.3 70.2,83.74 70.2,88.29 68.87,89.61 64.13,89.61 63.67,89.15
DATA_GPIO
  Top 0.254: J1.13 63.65,62.36 62.39,63.59 62.39,66.72 62.17,66.95
  Top 0.61: 62.17,66.95 59.01,66.95 55.78,70.23 48.46,70.23 39.78,78.86 39.78,84.76 44.11,89.1 47.67,89.1 49.65,91.07 55.77,91.07 56.02,90.83 IC1.14
DHT
  Bottom 0.254: J1.19 56.03,62.38 54.76,63.66 54.76,66.33 54.37,66.7
  Bottom 1.016: 54.37,66.7 51.21,66.7 43.07,74.84 41.53,74.84 R37.2
  Bottom 1.93: U1.DATA 33.84,77.61 36.66,74.79 41.48,74.79 R37.2
GND  (via drill 0.8)  (1 unrouted)
  Top 0.406: IC1.8 62.4,77.11 | 63.69,73.55 63.57,74.66 | IC4B.4 102.21,32.59 IC4.4 | IC4B.3 102.21,33.86 IC4.3 | IC5B.4 102.38,43.3 IC5.4
  Top 0.61: 17.64,124.39 19.11,124.4 | 19.11,124.4 20.1,124.4 20.65,124.41 20.88,124.18 20.88,115.42 21.41,114.88 | OK4.4 16.78,124.4 19.11,124.4
  Top 0.813: 102.55,33.9 102.22,33.9 IC4.3 | IC4.4 IC4.3 | IC4.3 99.95,33.87 99.72,34.09 99.72,42.11 100.81,43.2 | 97.03,43.2 100.81,43.2 | 100.81,43.2 100.95,43.34 IC5.4 | 63.57,72.22 63.69,73.55 62.4,77.11 | 63.57,72.22 63.57,64.9 J1.14 | v51.24,74.56 51.24,74.02 53.04,72.22 63.57,72.22
  Top 1.016: IC2.4 99.57,48.51 97.03,45.97 97.03,43.2
  Top 1.93: 138.58,39.01 138.58,47.48 138.97,47.87 POW5V.2 | EXT_OUT.3 73.81,81.16 73.9,81.5 76.43,81.5 77.9,80.03 79.55,80.03 | 79.55,80.03 v82.63,83.11 | J1.6 73.81,66.08 76.44,68.72 78.99,68.72 79.32,69.04 79.32,79.8 79.55,80.03 | C5.2 98.37,83.26 107.87,92.76 147.6,92.76 149.55,94.72 149.55,106.97 147.36,109.16 30.17,109.16 D3.A
  Bottom 0.254: J1.39 31.05,62.28 32.36,63.57 37.02,63.57 37.9,64.47 | 37.9,64.47 J1.34 | J1.30 43.33,64.64 | 43.33,64.64 42.2,63.55 38.85,63.55 37.9,64.47 | 43.33,64.64 43.33,64.49 44.59,63.27 44.59,61.29 45.11,60.72 46.85,60.72 J1.25 48.41,61.64 49.36,60.69 57.15,60.69 57.3,60.9 57.3,63.56 | 57.3,63.56 J1.20 | J1.6 72.6,63.58 70.34,63.58 69,62.28 J1.9 66.97,60.53 65.34,60.53 64.9,60.98 64.9,63.42 63.65,64.66 J1.14 62.34,63.56 57.3,63.56
  Bottom 0.406: v51.24,74.56 51.24,77.54 ULN1.9
  Bottom 0.61: 45.91,78.78 49.46,78.78 50.54,77.7 51.08,77.7 ULN1.9
  Bottom 0.813: C3.C- 45.91,78.78
  Bottom 1.778: C5.2 98.47,83.2 101.37,86.1 101.43,86.1 102.5,87.17 114.68,87.17 117.35,84.5 120.56,84.5 122.31,82.75 | 90.28,83.2 C18.C-
  Bottom 1.93: C2.C- C7.2 25.04,109.1 | LED13.K K9.2 42.82,109.1 D3.A 25.04,109.1 | 19.96,97.67 18.69,98.94 OK5.2 | 19.96,97.67 21.23,96.4 OK5.4 25.04,85.86 U1.GND 34.63,82.69 38.09,79.23 | 19.96,97.67 21.23,98.94 21.23,105.29 25.04,109.1 | 38.09,79.23 C6.2 37.99,79.59 | 38.09,79.23 38.38,79.2 C3.C- | 121.72,70.82 121.72,68.35 122.71,68.35 | 121.72,70.82 121.72,78.56 | 121.72,78.56 121.72,79.76 120.69,80.78 | 120.69,80.78 120.35,81.13 116.76,81.13 116.85,81.04 OK2.4 | OK3.2 127.83,86.01 125.57,86.01 122.31,82.75 121.12,81.56 121.12,81.21 120.69,80.78 | 120.69,80.78 | OK2.2 125.34,78.56 121.72,78.56 | 121.72,70.82 117.68,70.82 OK1.4 109.76,70.84 C4.C- | OK1.2 125.23,68.35 122.71,68.35 | OK6.2 121.4,50.1 123.41,48.1 | 123.41,48.1 123.75,47.76 125.05,47.76 OK6.4 131.34,47.56 133.75,49.97 | 133.75,49.97 D2.A 135.05,51.36 130.76,55.65 130.76,59.28 C17.2 126.7,59.29 122.77,63.22 122.77,68.29 122.71,68.35 | POW5V.2 135.84,47.87 133.75,49.97 | G1.- 117.67,24.6 IC3.4 IC3.3 120.87,37.28 121.37,37.77 121.37,46.06 123.41,48.1 | EXT_OUT.7 EXT_OUT.5 EXT_OUT.3 | v82.63,83.11 90.19,83.11 C18.C-
  other vias: 22.86,68.58 11.43,5.08 16.51,5.08 21.59,5.08 26.67,5.08 57.15,5.08 62.23,5.08 67.31,5.08 72.39,5.08 92.71,8.89 92.71,19.05 92.71,29.21 92.71,39.37 111.76,5.08 121.92,5.08 132.08,5.08 142.24,5.08 76.2,69.85 95.25,86.36 63.5,72.39 148.59,97.79 6.35,88.9 6.35,93.98 6.35,99.06 67.52,85.77
  pour Top (isolate 0.61): -4.62,110.52 158.89,110.22 157.8,-3.42 -3.95,-3.87 -3.31,27.76 24.16,27.64 24.65,27.6 77.08,27.6 77.08,53.07 -4.36,53.07 -4.6,71.41 -4.62,71.86
  pour Bottom (isolate 0.61): 0,-6.35 158.75,-6.35 158.75,109.22 -2.54,109.22 -2.54,-6.35
LATCH_GPIO
  Top 0.254: J1.15 61.59,62.28 62.84,60.99 64.79,60.99 64.92,61.17 64.92,69.11 70.47,74.65 70.47,75.76 EXT_OUT.6 70.36,76.25 69.12,77.5 69.12,81.84 R38.1
N$1
  Bottom 1.93: R36.1 126.52,55.77 LED14.A
N$2
  Top 2.54: 19.9,165.12 20.14,165.12 20.14,171.01 138.05,171.01 138.05,165.12
N$3
  Bottom 1.93: OK6.1 117.62,55.52 LED14.K
N$4
  Top 2.54: 125.52,165.24 125.52,170.65
N$5
  Top 2.54: 112.5,164.75 112.5,170.4
N$6
  Top 2.54: 99.98,165 100.1,165 100.1,170.65
N$7
  Top 2.54: 87.33,165.24 87.33,170.03
N$8
  Top 2.54: 74.43,165.85 74.55,165.85 74.55,170.65
N$9
  Top 2.54: 61.66,165.12 61.66,170.52
N$10
  Top 2.54: 49.01,165.61 49.01,170.28
N$11
  Top 2.54: 36.48,165.12 36.35,165.12 36.35,170.52
N$12
  Top 2.54: 25.06,164.38 25.06,152.96 28.62,152.96 28.62,126.17 144.93,126.17 144.93,125.8
N$13
  Top 0.61: R39.2 58.59,88.6 IC1.12 58.56,87.07 59.73,85.91 64.96,85.91 | 64.96,85.91 65.11,85.91 65.75,85.27 65.75,82.03 R38.2 | C19.2 64.93,85.94 64.96,85.91
N$14
  Bottom 1.422: 124.5,17.63 127.12,17.63
N$17
  Bottom 1.93: LED1.A 145.69,97.67 R1.1
N$18
  Bottom 1.93: LED2.A 132.99,97.67 R2.1
N$19
  Bottom 1.93: LED3.A 120.29,97.67 R3.1
N$20
  Bottom 1.93: LED4.A 107.59,97.67 R4.1
N$21
  Bottom 1.93: LED5.A 94.89,97.67 R5.1
N$22
  Bottom 1.93: LED6.A 82.19,97.67 R6.1
N$23
  Bottom 1.93: LED7.A 69.49,97.67 R7.1
N$24
  Bottom 1.93: LED8.A 56.79,97.67 R8.1
N$26
  Bottom 1.93: R9.1 129.62,63.15 132.9,66.43 132.9,67.84 LED9.A
N$27
  Bottom 1.016: OK1.1 125.31,65.8 128.71,65.8 130.35,67.44 LED9.K
N$28
  Bottom 1.016: 127.09,76 129.44,78.35 LED10.K
  Bottom 1.93: OK2.1 125.43,76 127.09,76
N$29
  Bottom 1.93: R10.1 129.43,73.31 133.06,76.94 LED10.A
N$30
  Bottom 1.93: R15.1 LED12.A
N$31
  Bottom 1.422: OK4.1 9.13,135.11 LED12.K
N$32
  Bottom 1.93: LED11.K 123.81,88.62 OK3.1
N$33
  Bottom 0.813: LED11.A 117.7,87.96 116.34,89.31 95.66,89.31 94.39,88.04 83.58,88.04 82.26,86.72 82.26,86.11 R14.2
N$36
  Bottom 1.93: C10.2 112.8,138.31 R24.1
N$37
  Bottom 1.93: C9.2 125.5,138.31 R23.1
N$38
  Bottom 1.93: C1.1 R21.2
N$39
  Bottom 1.93: C8.2 138.19,138.31 R22.1
N$40
  Bottom 1.93: C11.2 100.09,138.31 R25.1
N$41
  Bottom 1.93: C12.2 87.39,138.31 R26.1
N$42
  Bottom 1.93: Q4.2 39.64,93.86 R33.1
N$43
  Bottom 1.93: C13.2 74.69,138.31 R27.1
N$44
  Bottom 1.93: C14.2 61.99,138.31 R28.1
N$45
  Bottom 1.93: C15.2 49.3,138.31 R29.1
N$46
  Bottom 1.93: LED13.A 44.09,97.67 R30.1
N$47
  Bottom 1.93: C16.2 36.59,138.31 R31.1
N$49
  Bottom 1.93: R32.1 16.15,102.75 16.15,101.48 OK5.1
N$50
  Bottom 1.016: OK5.5 26.31,98.94 28.85,96.4 R34.2
  Bottom 1.93: R33.2 30.12,93.86 R34.2
N$51
  Bottom 1.016: Q4.3 33.93,90.05 33.93,91.32 36.47,93.86 36.47,95.13 34.56,97.04
  Bottom 1.93: R30.2 34.56,97.04 35.2,97.67 35.2,98.94 | 35.2,98.94 K9.1 | D3.C 35.2,98.94
N$53  (via drill 0.8)
  other vias: 80.01,74.93
N$56  (via drill 0.8)
  other vias: 132.08,83.82
NEUTRAL_230V
  Bottom 1.93: KON7.2 121.56,161.17 R23.2 | KON8.2 134.26,161.17 R22.2 | KON6.2 108.86,161.17 R24.2 | KON5.2 96.16,161.17 R25.2 | KON4.2 83.46,161.17 R26.2 | KON3.2 70.76,161.17 R27.2 | KON2.2 58.06,161.17 R28.2 | KON1.2 45.36,161.17 R29.2 | OUT9.2 32.66,161.17 R31.2 | IN230V.2 D1.A 5,165.06 4.77,127.52 5.51,127.04 OK4.2
  Bottom 2.54: IN230V.2 19.96,170.71 20.39,171.14 36.35,171.14 | 36.35,171.14 48.64,171.14 | 48.64,171.14 62.39,171.14 | 62.39,171.14 74.68,171.14 | 74.68,171.14 87.33,171.14 | 87.33,171.14 99.85,171.14 | 99.85,171.14 113.12,171.14 | 113.12,171.14 125.28,171.14 | 125.28,171.14 137.07,171.14 138.18,170.03 138.18,165.09 KON8.2 | OUT9.2 36.47,171.03 36.35,171.14 | KON1.2 49.17,170.61 48.64,171.14 | KON2.2 61.87,170.61 62.39,171.14 | KON3.2 74.57,171.03 74.68,171.14 | KON4.2 87.27,171.08 87.33,171.14 | KON5.2 99.97,171.02 99.85,171.14 | KON6.2 112.67,170.69 113.12,171.14 | KON7.2 125.37,171.05 125.28,171.14
O1
  Bottom 0.61: ULN1.18 61.89,88.06 68.88,88.06 69.54,88.72 81.36,88.72 82.43,89.79 93.83,89.79 94.84,90.8 126.56,90.8 129.71,93.95 139.92,93.95 141.11,95.14 141.11,100.19 142.4,101.48 LED1.K
  Bottom 1.93: K1.2 LED1.K
O2
  Bottom 0.61: ULN1.17 60.03,87.48 60.03,89.31 68.08,89.31 68.78,89.85 80.53,89.85 81.66,90.98 92.7,90.98 93.77,92.05 125.13,92.05 127.39,94.3 127.39,100.01 128.86,101.48 LED2.K
  Bottom 1.93: K2.2 LED2.K
O3
  Bottom 0.61: ULN1.16 58.75,88.02 58.75,90.32 58.82,90.39 67.3,90.39 68.08,91.03 79.66,91.03 80.71,92.18 91.4,92.18 92.47,93.25 113.78,93.25 115.7,95.17 115.7,100.74 116.45,101.48 LED3.K
  Bottom 1.93: K3.2 LED3.K
O4
  Bottom 0.61: ULN1.15 57.47,89.21 57.47,91.34 57.62,91.49 66.63,91.49 67.37,92.23 78.46,92.23 79.64,93.42 89.89,93.42 90.93,94.46 100.98,94.46 103.45,96.93 103.45,100.8 104.14,101.48 LED4.K
  Bottom 1.93: K4.2 LED4.K
O5
  Bottom 0.61: ULN1.14 56.19,89.23 56.22,92.46 56.68,92.58 65.69,92.58 66.58,93.47 77.22,93.47 78.31,94.56 88.01,94.56 90.68,97.23 90.68,100.7 91.47,101.48 LED5.K
  Bottom 1.93: LED5.K K5.2
O6
  Bottom 0.61: ULN1.13 54.95,91.21 54.95,93.42 55.14,93.62 64.25,93.62 65.29,94.66 75.93,94.66 78.41,97.13 78.41,100.65 79.24,101.48 LED6.K
  Bottom 1.93: K6.2 LED6.K
O7
  Bottom 0.61: ULN1.12 53.61,91.15 53.61,93.86 54.4,94.66 61.43,94.66 65.29,98.52 65.29,100.8 65.98,101.48 LED7.K
  Bottom 1.93: K7.2 LED7.K
O8
  Bottom 0.61: ULN1.11 52.32,91.17 52.32,100.55 53.26,101.48 LED8.K
  Bottom 1.93: LED8.K K8.2
OE_GPIO
  Top 0.254: 67.78,75.83 EXT_OUT.8
  Top 0.61: 67.78,75.83 65.13,75.83 64.31,76.64 64.31,84.04 63.73,84.62 58.1,84.62 57.31,85.42 57.31,88.55 IC1.13
  Bottom 0.254: 67.48,66.06 67.48,63.55 J1.11
  Bottom 0.406: R11.2 68.5,83.39 67.04,83.39 65.56,81.91 65.56,76.19 65.92,75.83 67.78,75.83 EXT_OUT.8 67.82,66.42 67.48,66.06
OS  (via drill 0.8)
  Top 0.406: IC4B.1 102.21,36.4 IC4.1
  Top 0.813: IC4.1 102.16,36.44 102.16,39.12 103.36,40.31 113.7,40.31 115.7,42.31 117.63,42.31 IC3.1 | v113.23,52.52 113.23,53.16 112.69,53.7
  Top 1.016: R35.2 105.86,59.4 111.55,53.7 112.69,53.7 113.92,53.7 115.84,55.63 119.72,55.63 OK6.5
  Bottom 0.813: IC3.1 116.05,42.36 114.51,43.89 114.51,51.24 v113.23,52.52
OUT1
  Bottom 1.93: K1.S2 K1.S1 144.42,158.63 | KON8.1 144.42,163.71 144.42,158.63 | C8.1 140.74,158.63 144.42,158.63
OUT2
  Bottom 1.93: K2.S2 K2.S1 131.72,134.5 127.91,143.39 C9.1 KON7.1
OUT3
  Bottom 1.93: K3.S2 K3.S1 119.02,134.5 115.21,143.39 C10.1 KON6.1
OUT4
  Bottom 1.93: K4.S2 K4.S1 106.32,134.5 102.51,143.39 C11.1 KON5.1
OUT5
  Bottom 1.93: K5.S2 K5.S1 93.62,134.5 89.81,143.39 C12.1 KON4.1
OUT6
  Bottom 1.93: K6.S2 K6.S1 80.92,134.5 77.11,143.39 C13.1 KON3.1
OUT7
  Bottom 1.93: K7.S2 K7.S1 68.22,134.5 64.41,143.39 C14.1 KON2.1
OUT8
  Bottom 1.93: K8.S2 K8.S1 55.52,134.5 51.71,143.39 C15.1 KON1.1
OUT9
  Bottom 1.93: K9.S2 K9.S1 42.82,134.5 39.01,143.39 C16.1 OUT9.1
PHASE_230V
  Bottom 1.93: K1.P1 K1.P2 K2.P1 K2.P2 K3.P1 K3.P2 K4.P1 | 105.05,125.61 K4.P1 | K4.P1 K4.P2 K5.P1 K5.P2 K6.P1 K6.P2 K7.P1 K7.P2 | 59.33,125.61 K7.P2 | K7.P2 K8.P1 K8.P2 K9.P1 K9.P2 30.12,125.61 28.19,128.59 28.19,151.45 26.31,152.28 25.04,152.28 | R21.1 25.04,152.28 | 25.04,152.28 IN230V.1
POWER_OK_GPIO
  Top 0.254: 57.04,66.94 57.04,66.3 57.3,66.07 57.3,64.22 57.89,63.58 59.88,63.58 J1.16
  Top 1.016: C7.1 18.69,105.13 21.57,102.25 21.57,78.8 31.8,68.56 55.42,68.56 57.04,66.94
  Bottom 0.61: OK4.5 18.54,126.97 19.81,125.7 19.81,118.79 C2.C+ 13.8,117.37 R16.2
  Bottom 1.93: C2.C+ C7.1
PRESS1
  Bottom 1.93: R10.2 PRESSURE.1
PRESS_GPIO  (via drill 0.8)
  Top 0.406: J1.12 66.19,66.84 v69.01,69.66 | R13.2 106.22,83.01 104.71,81.49 99.17,81.49 93.84,76.17 93.84,75.03 93.2,74.39 83.25,74.39 v81.41,72.28
  Bottom 0.406: v69.01,69.66 73.69,69.66 76.29,72.26 v81.41,72.28
  Bottom 0.813: OK2.5 116.72,78.5 115.08,80.14 115.08,81.21 R13.2
Q1-1
  Top 0.305: IC5.1 102.35,52.16 100.8,53.7 92.42,53.7 91.88,53.16 91.88,51.13 IC2.1
  Top 0.406: IC5B.1 102.39,47.11 IC5.1
  Bottom 1.016: Q1.1 91.77,50.86 IC2.1
Q1-2  (via drill 0.8)
  Top 0.305: IC5.2 102.5,45.87 106.33,45.87 106.9,46.45 106.9,49.33 101.1,55.13 90.69,55.13 v89.51,53.95
  Top 0.406: IC5B.2 102.53,45.84 102.5,45.87
  Bottom 0.305: v89.51,53.95 92.12,53.95 94.44,51.63 94.44,51.1 IC2.2
  Bottom 1.016: Q1.2 94.31,50.86 IC2.2
QA  (via drill 0.8)
  Top 0.61: IC1.15 54.75,86.43 54.24,85.92 52.94,85.92 51.98,84.96 51.98,80.51 v52.02,80.47
  Bottom 0.61: v52.02,80.47 52.02,79.58 52.39,79.21 ULN1.8
QB  (via drill 0.8)
  Top 0.406: v53.66,75.35 53.66,82.25 IC1.1
  Bottom 0.406: ULN1.7 v53.66,75.36 v53.66,75.35
QC  (via drill 0.8)
  Top 0.406: v54.99,74.22 54.99,82.19 IC1.2
  Bottom 0.406: ULN1.6 54.93,74.28 v54.99,74.22
  Bottom 0.61: ULN1.6 54.95,77.64
QD  (via drill 0.8)
  Top 0.406: v56.22,75.35 56.22,82.22 IC1.3
  Bottom 0.406: ULN1.5 56.2,75.37 v56.22,75.35
QE  (via drill 0.8)
  Top 0.406: v57.4,74.12 57.4,82.31 IC1.4
  Bottom 0.406: ULN1.4 57.47,74.19 v57.4,74.12
  Bottom 0.61: ULN1.4 57.49,77.64
QF  (via drill 0.8)
  Top 0.406: v58.69,75.3 58.69,82.3 IC1.5
  Bottom 0.406: ULN1.3 58.74,75.36 v58.69,75.3
  Bottom 0.61: ULN1.3 58.76,77.64
QG  (via drill 0.8)
  Top 0.406: v60.07,74.02 60.07,82.19 IC1.6
  Bottom 0.406: ULN1.2 60.01,74.08 v60.07,74.02
  Bottom 0.61: ULN1.2 60.03,77.64
QH  (via drill 0.8)
  Top 0.406: v61.35,75.35 61.35,82.18 IC1.7
  Bottom 0.406: ULN1.1 61.28,75.42 v61.35,75.35
  Bottom 0.61: ULN1.1 61.3,77.64
QH*  (via drill 0.8)
  Top 0.61: v72.29,83.49 71.19,84.58 71.19,89.23 69.44,90.98 62.91,90.98 62.32,90.39 62.32,88.63 IC1.9
  Bottom 0.254: 74.18,80.03 74.18,77.09 EXT_OUT.2
  Bottom 0.61: v72.29,83.49 72.29,81.91 74.18,80.03
RAIN1
  Bottom 1.93: R9.2 142.16,63.15 RAIN.1
RAIN_GPIO  (via drill 0.8)
  Top 0.254: J1.8 71.27,64.28 72.53,62.96 72.53,60.58 75.61,60.58 76.23,59.96 88.13,59.96 89.31,61.13 93.52,61.13 95.88,63.5 95.88,70.48 v95.39,70.97 | v95.84,76.11 v101.93,76.11
  Bottom 0.254: v95.39,70.97 95.39,75.66 v95.84,76.11 | v101.93,76.11 104.47,76.11 107.43,73.15
  Bottom 0.813: OK1.5 107.97,68.3 106.61,69.66 106.61,72.33 107.43,73.15 109.28,75 111.34,75 113.35,77.02 113.35,79.83 R12.2
RELAY_GPIO
  Top 0.254: J1.10 68.73,64.13 67.46,62.87 67.46,61.3 66.69,60.53 30.04,60.53 29.06,61.51 29.06,68.85
  Top 1.016: R32.2 13.61,84.3 29.06,68.85
SCL5V
  Top 0.406: IC4B.6 110.08,33.87 IC4.6 | IC5B.6 111.42,44.57
  Top 0.61: 123.7,36.41 121.99,38.12 121.99,43.29 121.11,44.17 114.53,44.17 114.1,44.6 IC5.6 112.01,44.57 111.42,44.57
  Top 0.813: IC4.6 113.87,33.87 115.25,32.5 119.78,32.5 123.7,36.41 124.52,37.23 125.25,37.23 | 125.25,37.23 IC3.6 | 125.25,37.23 128.16,37.23 129.11,38.18 129.11,56.35 123.13,62.33 113.57,62.33 R17.2
  Top 1.016: IC2.6 97.03,62.18 | 97.03,62.18 97.03,63.79 Q2.D | R17.2 106.68,62.36 104.52,64.52 102.79,64.52 100.49,62.22 97.08,62.22 97.03,62.18
  Bottom 0.406: 133.74,33.63 133.74,33.52 | I2C-5V-0.3 134.39,33.54 | I2C-5V-2.3
  Bottom 0.61: I2C-5V-0.3 133.84,33.52 133.74,33.63
  Bottom 1.27: IC3.6 130.09,37.28 133.74,33.63 | 134.39,33.54 I2C-5V-1.3 I2C-5V-2.3 | I2C-5V-2.3 141.02,33.57 I2C-5V-3.3
SCL_GPIO
  Top 0.254: J1.5 74.23,62.28 75.54,63.55 79.99,63.55 80.43,63.99 80.43,67.56 81.91,69.04 81.91,71.22 83.02,72.33 87.37,72.33 R20.2
  Top 1.016: R20.2 94.52,72.5 96.6,74.58 99.14,74.58 100.03,73.69 100.03,67.46 100.54,66.95 100.54,64.75 Q2.S
SDA5V  (via drill 0.35, 0.8)
  Top 0.305: v99.57,60.77 100.48,60.77 102.48,60.95 108.92,60.95 R18.2
  Top 0.406: IC4B.5 111.87,32.59 IC4.5
  Top 0.61: v107.82,43.77 108.02,43.56 108.02,43.3 108.63,43.3 IC5B.5 112.01,43.3 IC5.5
  Top 0.813: IC4.5 111.89,31.49 112.56,30.81 | 112.56,30.81 122.04,30.81 125.35,34.12 125.35,34.69 IC3.5 | v112.59,29 112.59,30.79 112.56,30.81
  Bottom 0.406: 141.02,31.03 I2C-5V-2.2 | I2C-5V-1.2 137.7,30.98 | 133.32,30.98 133.16,31.14
  Bottom 0.813: R18.2 112.42,56.39 107.82,51.79 v107.82,43.77 107.82,29.77 108.64,28.95 112.54,28.95 v112.59,29
  Bottom 1.016: Q3.D 91.74,63.35 93.59,61.5 98.55,61.5 99.58,60.48 v99.57,60.77 IC2.5
  Bottom 1.27: IC3.5 129.56,34.74 133.16,31.14 | I2C-5V-3.2 141.02,31.03 | I2C-5V-2.2 I2C-5V-1.2 | 137.7,30.98 I2C-5V-0.2 133.32,30.98
SDA_GPIO
  Top 0.254: J1.3 76.35,60.97 76.66,60.65 87.47,60.65 88.65,61.83 92.21,61.83 94.28,63.9 Q3.S
  Top 1.016: R19.2 93.67,69.54 94.99,68.21 94.99,64.73 Q3.S
TO_UPS_POWER_OFF_GPIO
  Bottom 0.406: J1.18 58.73,64.82 61.16,67.25 65.07,67.25 66.19,68.37 66.19,74.23 64.64,75.55 64.61,83.48 71.83,86.12 R14.1
UPS1
  Bottom 1.93: OK3.4 135.54,83.55 UPS_DOWN.1
UPS2
  Bottom 1.93: OK3.5 135.56,86.03 137.13,86.03 137.51,86.41 138.81,86.41 141.03,88.63 UPS_DOWN.2
UPS_POWER_OK
  Bottom 1.93: D1.C R15.2 13.61,147.2 C1.2
VCC  (via drill 0.8)
  Top 0.254: R39.1 59.27,93.92 59.33,93.98
  Top 0.406: IC4B.8 110.08,36.41 IC4.8 | IC5B.8 112.01,47.11 IC5.8
  Top 0.61: 61.04,92.84 61.1,92.78 IC1.10 | 53.48,92.8 53.44,92.84 | IC1.16 50.22,88.57 v49.11,87.46
  Top 0.813: IC5.8 113.81,47.14 115.14,45.81 123.61,45.81 125.29,44.12 IC3.8 | v114.29,37.42 113.28,36.41 IC4.8
  Top 1.016: IC5.8 112.04,49.94 v110.73,51.25 105.59,56.39 R18.1
  Top 1.93: R7.2 59.33,93.98 58.18,92.84 | 58.18,92.84 53.44,92.84 48.25,92.84 v46.43,91.02 | 58.18,92.84 61.04,92.84 70.44,92.84 73.14,90.13 84.82,90.13 v84.85,78.21
  Bottom 0.406: I2C-5V-0.1 134.39,28.46 | I2C-5V-2.1 | 144.31,28.46 I2C-5V-3.1
  Bottom 0.61: ULN1.10 v49.11,87.46 46.54,87.46 46.43,87.56 | 134.4,42.36 135.14,41.62 D2.C
  Bottom 0.813: v110.73,51.25 109.36,49.88 109.36,41.71 109.35,41.7 111.34,39.72 113.55,39.72 114.29,38.97 v114.29,37.42 | v84.85,78.21 83.75,78.21 83.62,78.08
  Bottom 1.93: R8.2 46.63,104.02 K8.1 47.9,109.1 60.6,109.1 | 60.6,109.1 K7.1 59.33,104.02 R7.2 | 73.3,109.1 K6.1 72.03,104.02 R6.2 | 73.3,109.1 60.6,109.1 | 86,109.1 K5.1 84.73,104.02 R5.2 | 86,109.1 73.3,109.1 | 98.7,109.1 K4.1 97.43,104.02 R4.2 | 98.7,109.1 86,109.1 | 111.4,109.1 K3.1 110.13,104.02 R3.2 | 111.4,109.1 98.7,109.1 | 124.1,109.1 K2.1 122.83,104.02 R2.2 | 124.1,109.1 111.4,109.1 | 136.8,109.1 K1.1 135.53,104.02 R1.2 | 136.8,109.1 124.1,109.1 | R34.1 37.74,86.24 | 37.74,86.24 Q4.1 | C6.1 37.74,84.92 | 37.74,84.92 37.74,86.24 | RAIN.2 142.34,68.14 146.32,68.14 | 146.32,68.14 146.41,68.22 146.41,78.42 146.4,78.41 PRESSURE.2 146.46,78.42 151.25,82.34 151.32,107.54 149.64,109.1 136.8,109.1 | 37.74,84.92 44.85,84.92 C3.C+ 46.43,85.23 46.43,87.56 v46.43,91.02 | J1.4 J1.2 79.16,65.09 79.16,69.14 79.6,69.58 82.8,69.58 84.13,70.92 84.13,77.78 84.43,78.08 | C18.C+ 84.43,78.08 | 84.43,78.08 83.62,78.08 79.63,78.08 79.63,78.41 | C17.1 140.94,59.29 WIND.2 144.25,58.03 146.21,59.99 | 146.21,59.99 146.34,60.12 146.34,68.12 146.32,68.14 | 144.79,42.79 POW5V.1 136.73,42.79 D2.C | 144.79,42.79 146.43,44.43 146.43,59.78 146.21,59.99 | IC3.8 134.4,42.36 | 144.79,42.79 149.1,38.48 149.1,30.76 146.8,28.46 144.31,28.46 I2C-5V-2.1 | IC2.8 92.12,58.5 92.12,56.27 93.45,54.94 101.15,54.94 102.61,56.39 R18.1 107.14,56.39 110.27,59.52 | R17.1 107.44,62.36 110.27,59.52 | 110.27,59.52 113.41,59.52 R35.1 | 79.63,78.41 79.63,81.57 R11.1 | EXT_OUT.1 79.63,78.41 | 134.39,28.46 I2C-5V-1.1 I2C-5V-2.1
WIND
  Bottom 1.93: R36.2 139.37,55.77 WIND.1
(copper drawn outside any net)
  shapes: Bottom area x1

### Text on the board
Bottom: IN230V | OUTRELE | OUT1 | OUT2 | OUT3 | OUT4 | OUT5 | OUT6 | OUT7 | OUT8 | UPSOUT | PRESS | RAIN | WIND | POW5V
tNames: IN230V | OUTRELE | OUT1 | OUT2 | OUT3 | OUT4 | OUT5 | OUT6 | OUT7 | OUT8 | WWW.PIHRT.COM 025-12042020 REV3.3 | UPS OUT | PRESS | RAIN | WIND | 0V | +5V | 0V | SCL | SDA | VCC | I2C | MASTER BOARD OSPy